# EAGLE design B141X (EAGLE 6.6.0)
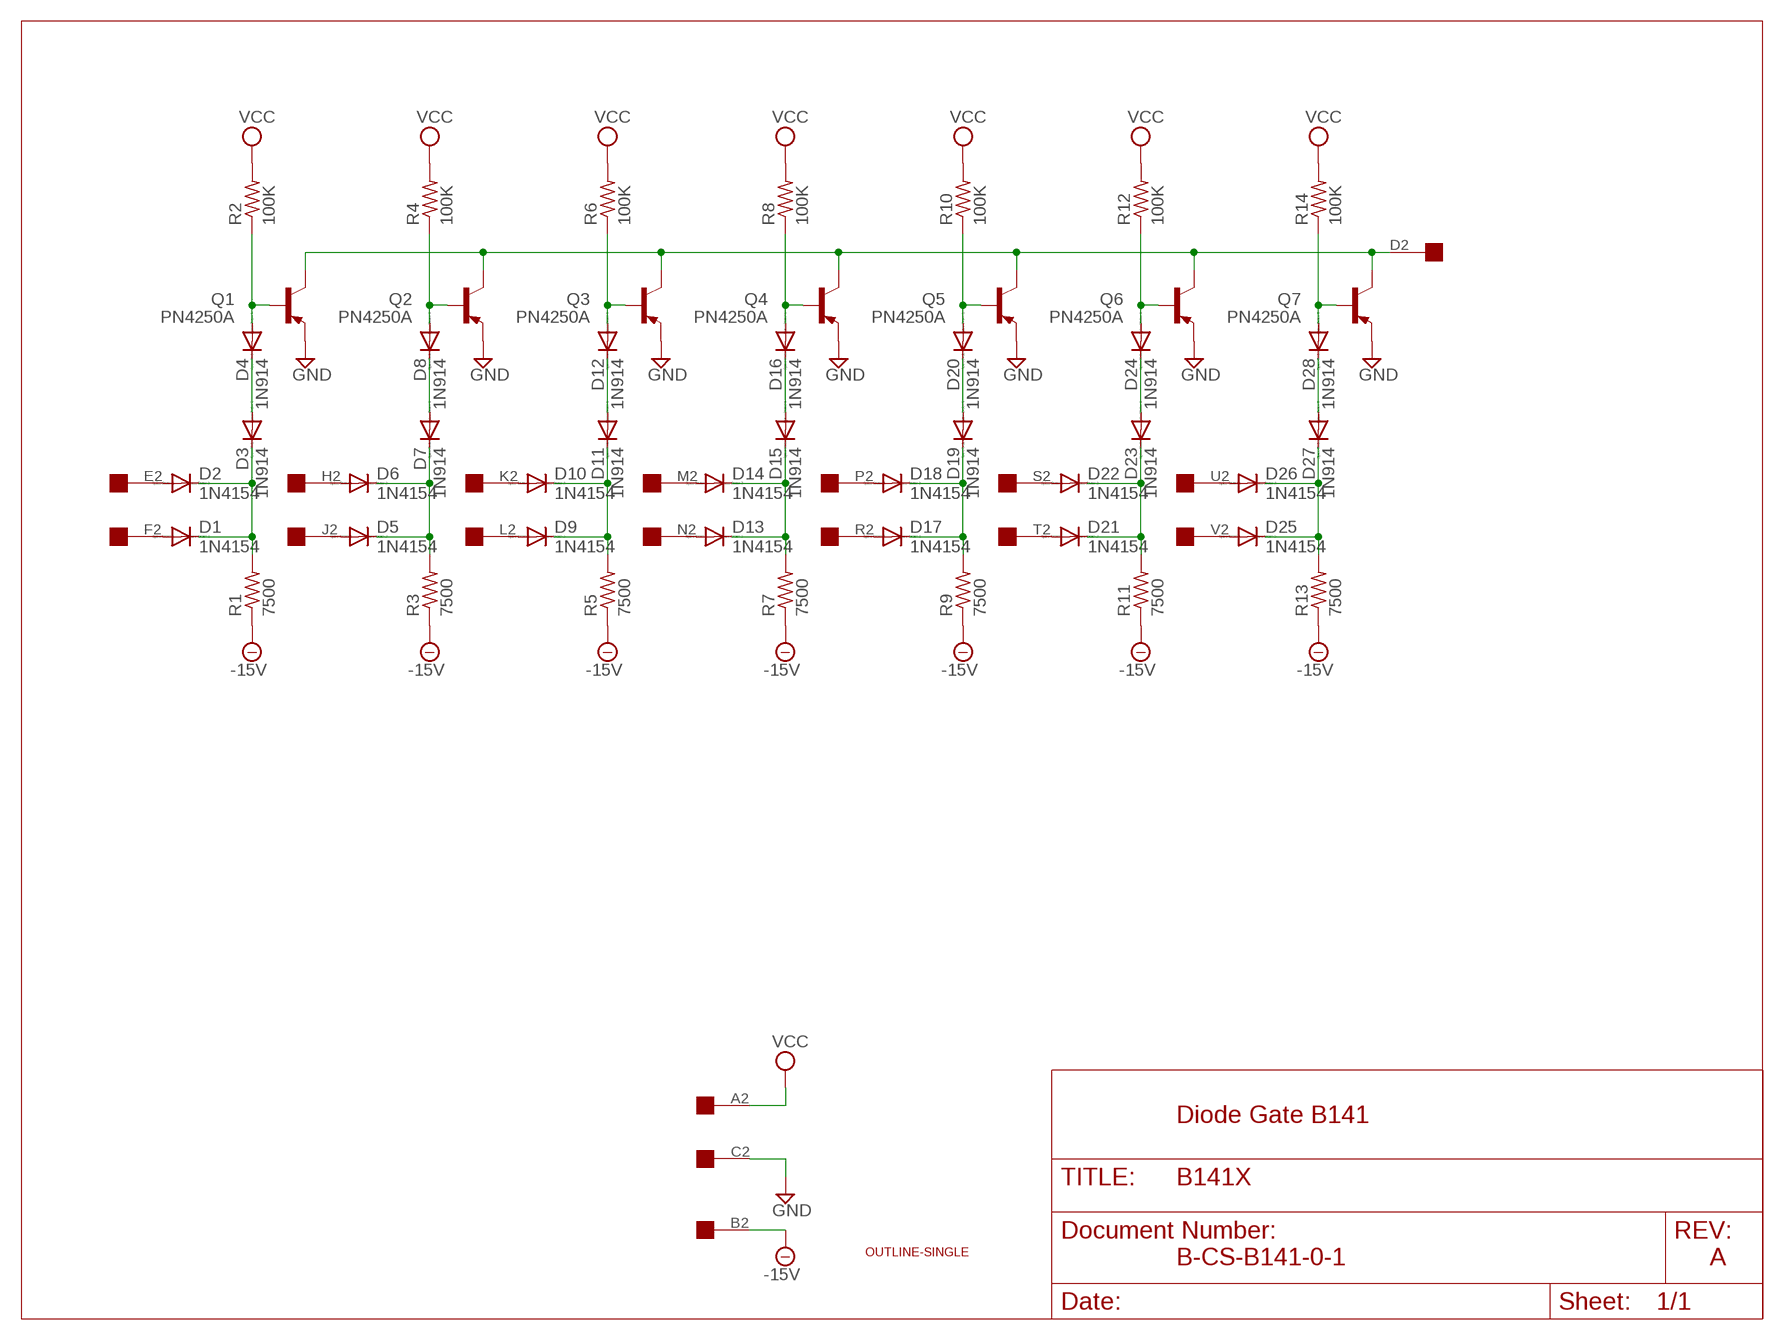
[diagram p0: schematic, sheet 1]

## Parts
D1  1N4154  DIODE-DO35-10  [DO35-10]
D2  1N4154  DIODE-DO35-10  [DO35-10]
D3  1N914  DIODE-DO35-10  [DO35-10]
D4  1N914  DIODE-DO35-10  [DO35-10]
D5  1N4154  DIODE-DO35-10  [DO35-10]
D6  1N4154  DIODE-DO35-10  [DO35-10]
D7  1N914  DIODE-DO35-10  [DO35-10]
D8  1N914  DIODE-DO35-10  [DO35-10]
D9  1N4154  DIODE-DO35-10  [DO35-10]
D10  1N4154  DIODE-DO35-10  [DO35-10]
D11  1N914  DIODE-DO35-10  [DO35-10]
D12  1N914  DIODE-DO35-10  [DO35-10]
D13  1N4154  DIODE-DO35-10  [DO35-10]
D14  1N4154  DIODE-DO35-10  [DO35-10]
D15  1N914  DIODE-DO35-10  [DO35-10]
D16  1N914  DIODE-DO35-10  [DO35-10]
D17  1N4154  DIODE-DO35-10  [DO35-10]
D18  1N4154  DIODE-DO35-10  [DO35-10]
D19  1N914  DIODE-DO35-10  [DO35-10]
D20  1N914  DIODE-DO35-10  [DO35-10]
D21  1N4154  DIODE-DO35-10  [DO35-10]
D22  1N4154  DIODE-DO35-10  [DO35-10]
D23  1N914  DIODE-DO35-10  [DO35-10]
D24  1N914  DIODE-DO35-10  [DO35-10]
D25  1N4154  DIODE-DO35-10  [DO35-10]
D26  1N4154  DIODE-DO35-10  [DO35-10]
D27  1N914  DIODE-DO35-10  [DO35-10]
D28  1N914  DIODE-DO35-10  [DO35-10]
Q1  PN4250A  -PNP-TO5  [TO5]
Q2  PN4250A  -PNP-TO5  [TO5]
Q3  PN4250A  -PNP-TO5  [TO5]
Q4  PN4250A  -PNP-TO5  [TO5]
Q5  PN4250A  -PNP-TO5  [TO5]
Q6  PN4250A  -PNP-TO5  [TO5]
Q7  PN4250A  -PNP-TO5  [TO5]
R1  7500  R-US_0207/10  [0207/10]
R2  100K  R-US_0207/10  [0207/10]
R3  7500  R-US_0207/10  [0207/10]
R4  100K  R-US_0207/10  [0207/10]
R5  7500  R-US_0207/10  [0207/10]
R6  100K  R-US_0207/10  [0207/10]
R7  7500  R-US_0207/10  [0207/10]
R8  100K  R-US_0207/10  [0207/10]
R9  7500  R-US_0207/10  [0207/10]
R10  100K  R-US_0207/10  [0207/10]
R11  7500  R-US_0207/10  [0207/10]
R12  100K  R-US_0207/10  [0207/10]
R13  7500  R-US_0207/10  [0207/10]
R14  100K  R-US_0207/10  [0207/10]
U$1  OUTLINE-SINGLE  [SINGLE]
U$2  EDGE-1  [EDGE-CON1]

## Nets
-15V: R1.1 R3.1 R5.1 R7.1 R9.1 R11.1 R13.1 U$2.B2
GND: Q1.1(E) Q2.1(E) Q3.1(E) Q4.1(E) Q5.1(E) Q6.1(E) Q7.1(E) U$2.C2
N$1: D2.A U$2.E2
N$2: D1.C D2.C D3.C R1.2
N$3: D3.A D4.C
N$4: D1.A U$2.F2
N$5: D4.A Q1.2(B) R2.1
N$6: Q1.3(C) Q2.3(C) Q3.3(C) Q4.3(C) Q5.3(C) Q6.3(C) Q7.3(C) U$2.D2
N$7: D5.C D6.C D7.C R3.2
N$8: D7.A D8.C
N$9: D8.A Q2.2(B) R4.1
N$10: D6.A U$2.H2
N$11: D9.C D10.C D11.C R5.2
N$12: D11.A D12.C
N$13: D12.A Q3.2(B) R6.1
N$14: D10.A U$2.K2
N$15: D13.C D14.C D15.C R7.2
N$16: D15.A D16.C
N$17: D16.A Q4.2(B) R8.1
N$18: D9.A U$2.L2
N$19: D14.A U$2.M2
N$20: D17.C D18.C D19.C R9.2
N$21: D19.A D20.C
N$22: D13.A U$2.N2
N$23: D20.A Q5.2(B) R10.1
N$24: D18.A U$2.P2
N$25: D21.C D22.C D23.C R11.2
N$26: D23.A D24.C
N$27: D24.A Q6.2(B) R12.1
N$28: D17.A U$2.R2
N$29: D25.C D26.C D27.C R13.2
N$30: D27.A D28.C
N$31: D28.A Q7.2(B) R14.1
N$32: D22.A U$2.S2
N$33: D5.A U$2.J2
N$34: D21.A U$2.T2
N$35: D26.A U$2.U2
N$36: D25.A U$2.V2
VCC: R2.2 R4.2 R6.2 R8.2 R10.2 R12.2 R14.2 U$2.A2

## Notes on the sheet
- Diode Gate B141
- B-CS-B141-0-1 | A

## Library data of the parts
D1-D28 = diode:DIODE-: DIODE
Q1-Q7 = transistor:*-PNP-: PNP Transistror
R1-R14 = rcl:R-US_: RESISTOR, American symbol
U$1 = dec-con:OUTLINE-*: Board outlines for DEC boards.
U$2 = dec-con:EDGE-1: Single-Sided DEC Edge Connector -- (side 2)

## Net classes
0 default: width 0.813 mm

## Board
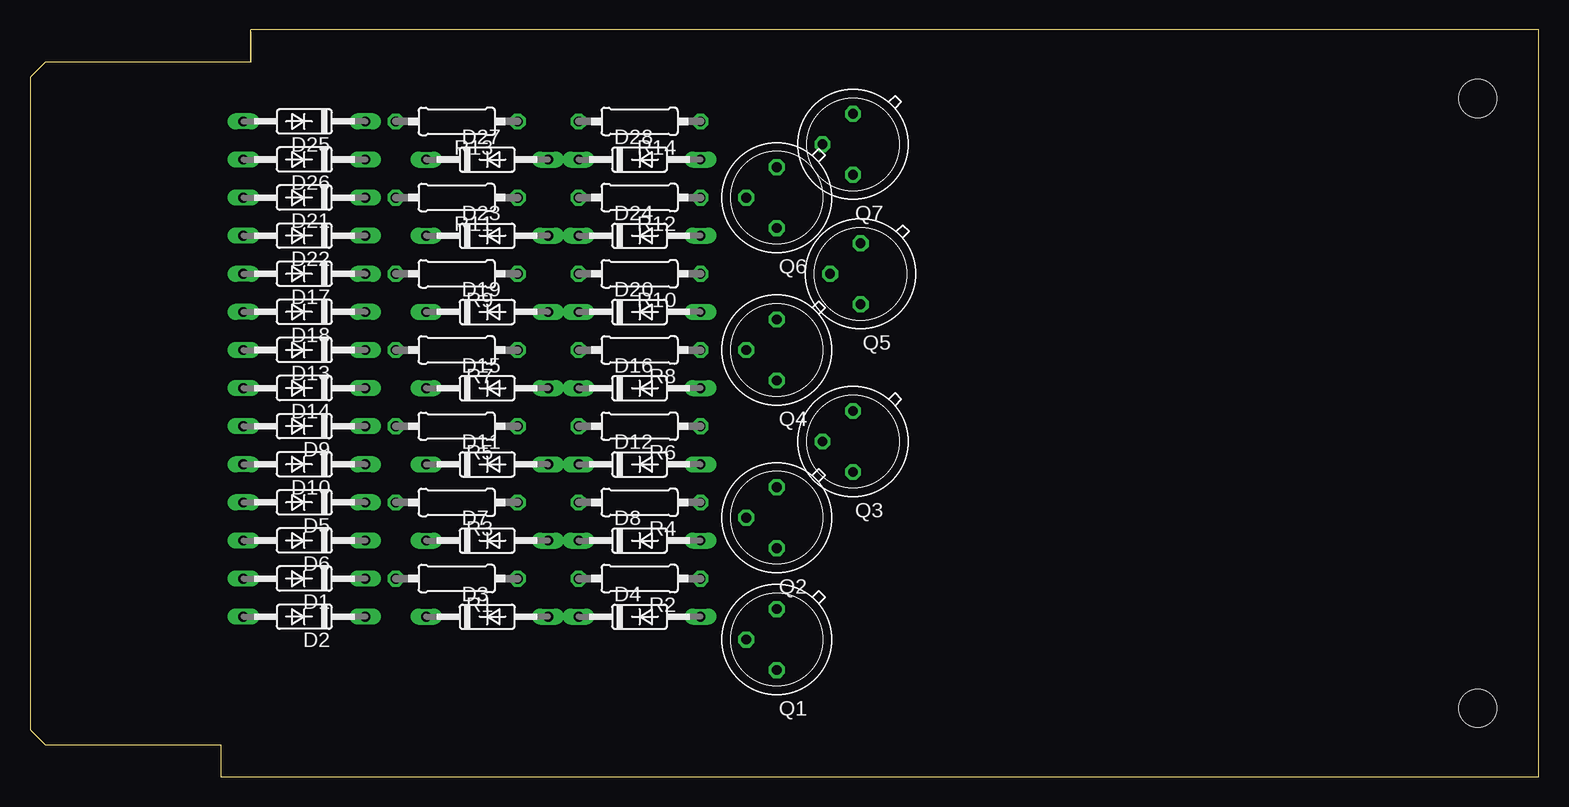
[diagram p1: board, top side]
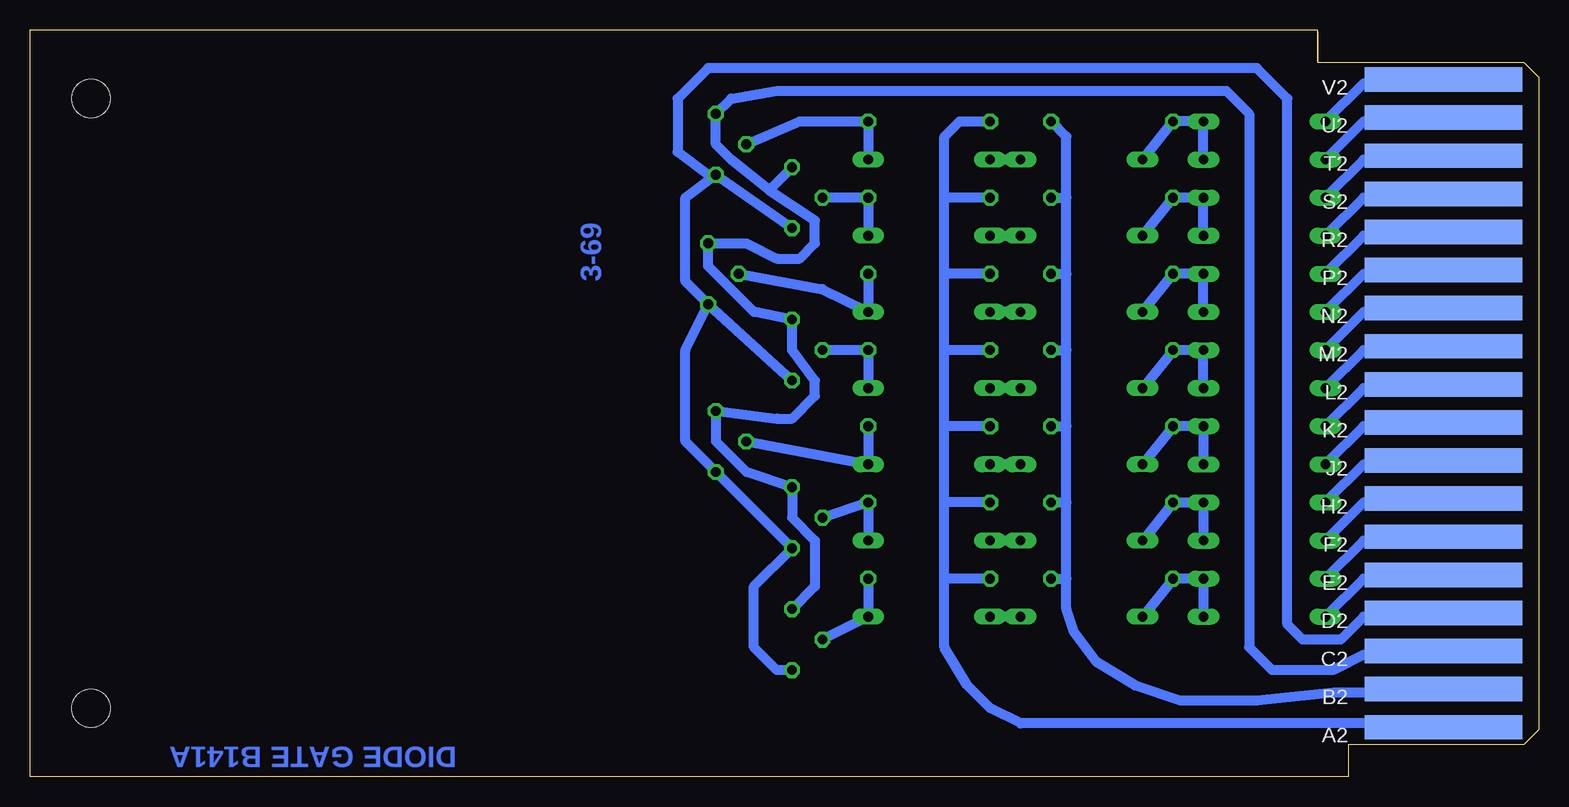
[diagram p2: board, bottom side, seen from below]

Size 125.73 x 62.23 mm. Coordinates in mm from the lower left corner, seen from the top.
Copper layers (1+16): Top 0.035mm / dielectric 1.5mm / Bottom 0.035mm
Design rules "16mils": minimum track width 16mil, minimum drill 32mil, track to track 15mil, track to pad 10mil, pad to pad 10mil, via to via 10mil, smd to smd 10mil, copper to edge 13mil, drill to drill 10mil, minimum pad ring 10mil, minimum via ring 8mil, stop-mask expansion 0mil, vias tented up to drill 0mil, thermal gap 10mil

### Footprints (pad centres in the part's own frame; a part is rotated, then mirrored left to right if it is on the bottom)
DO35-10 = drill 0.813 long: A 5.08,0; C -5.08,0
TO5 = drill 0.813 octagon: 1 0,-2.54; 2 2.54,0; 3 0,2.54
0207/10 = drill 0.813 octagon: 1 -5.08,0; 2 5.08,0
SINGLE = hole 3.175: 120.65,56.515; 120.65,5.715
EDGE-CON1 = smd 13.106 x 2.032 bottom: A2 7.938,4.128; B2 7.938,7.303; C2 7.938,10.477; D2 7.938,13.652; E2 7.938,16.828; F2 7.938,20.003; H2 7.938,23.177; J2 7.938,26.352; K2 7.938,29.527; L2 7.938,32.703; M2 7.938,35.877; N2 7.938,39.053; P2 7.938,42.227; R2 7.938,45.403; S2 7.938,48.578; T2 7.938,51.752; U2 7.938,54.928; V2 7.938,58.102

### Placement (x,y rotation side)
D1  22.86,16.51 180 top
D2  22.86,13.34 180 top
D3  38.1,13.34 0 top
D4  50.8,13.34 0 top
D5  22.86,22.86 180 top
D6  22.86,19.68 180 top
D7  38.1,19.68 0 top
D8  50.8,19.68 0 top
D9  22.86,29.21 180 top
D10  22.86,26.04 180 top
D11  38.1,26.04 0 top
D12  50.8,26.04 0 top
D13  22.86,35.56 180 top
D14  22.86,32.38 180 top
D15  38.1,32.38 0 top
D16  50.8,32.38 0 top
D17  22.86,41.91 180 top
D18  22.86,38.73 180 top
D19  38.1,38.73 0 top
D20  50.8,38.73 0 top
D21  22.86,48.26 180 top
D22  22.86,45.09 180 top
D23  38.1,45.09 0 top
D24  50.8,45.09 0 top
D25  22.86,54.61 180 top
D26  22.86,51.44 180 top
D27  38.1,51.44 0 top
D28  50.8,51.44 0 top
Q1  62.23,11.43 180 top
Q2  62.23,21.59 180 top
Q3  68.58,27.94 180 top
Q4  62.23,35.56 180 top
Q5  69.22,41.91 180 top
Q6  62.23,48.26 180 top
Q7  68.58,52.7 180 top
R1  35.56,16.51 180 top
R2  50.8,16.51 180 top
R3  35.56,22.86 180 top
R4  50.8,22.86 180 top
R5  35.56,29.21 180 top
R6  50.8,29.21 180 top
R7  35.56,35.56 180 top
R8  50.8,35.56 180 top
R9  35.56,41.91 180 top
R10  50.8,41.91 180 top
R11  35.56,48.26 180 top
R12  50.8,48.26 180 top
R13  35.56,54.61 180 top
R14  50.8,54.61 180 top
U$1  0,0 0 top
U$2  0,0 0 top

### Tracks (layer width: path | path; a pad name or v marks a point on that pad's centre or on a via)
-15V
  Bottom 0.813: U$2.B2 8.26,6.99 17.15,6.99 23.5,6.35 29.85,6.35 33.66,7.62 36.83,9.53 38.74,12.06 39.37,13.97 39.37,16.51 | 39.37,16.51 39.37,22.86 | 39.37,22.86 39.37,29.21 | 39.37,29.21 39.37,35.56 | 39.37,35.56 39.37,41.91 | 39.37,41.91 39.37,48.26 | 39.37,48.26 39.37,53.34 R13.1 | R11.1 39.37,48.26 | R9.1 39.37,41.91 | R7.1 39.37,35.56 | R5.1 39.37,29.21 | R3.1 39.37,22.86 | R1.1 39.37,16.51
GND
  Bottom 0.813: Q1.1 60.33,15.88 60.33,19.68 62.23,21.59 Q2.1 66.04,25.4 68.58,27.94 Q3.1 63.5,29.84 62.23,29.84 60.33,31.75 60.33,33.02 62.23,35.56 Q4.1 65.41,38.73 69.22,42.55 Q5.1 66.04,44.45 63.5,43.18 61.6,43.18 60.33,44.45 60.33,46.35 64.14,48.9 | Q6.1 64.14,48.9 | 64.14,48.9 67.31,51.44 68.58,52.7 Q7.1 67.31,56.52 63.5,57.15 26.04,57.15 24.13,55.24 24.13,10.79 22.23,8.89 17.15,8.89 14.61,10.16 8.89,10.16 U$2.C2
N$1
  Bottom 0.813: U$2.E2 8.26,16.51 14.61,16.51 D2.A
N$2
  Bottom 0.813: D2.C D1.C R1.2 D3.C
N$3
  Bottom 0.813: D3.A D4.C
N$4
  Bottom 0.813: U$2.F2 8.26,19.68 14.61,19.68 D1.A
N$5
  Bottom 0.813: Q1.2 D4.A R2.1
N$6
  Bottom 0.813: U$2.D2 8.26,13.34 14.61,13.34 16.51,11.43 19.69,11.43 20.96,12.7 20.96,56.52 23.5,59.05 69.22,59.05 71.76,56.52 71.76,52.07 69.22,50.16 Q7.3 | Q7.3 Q6.3 | Q4.3 Q5.3 | Q1.3 63.5,8.89 65.41,10.79 65.41,15.88 Q2.3 Q3.3 71.12,27.94 71.12,35.56 Q5.3 | Q5.3 71.12,41.27 71.12,48.26 Q7.3
N$7
  Bottom 0.813: D7.C R3.2 D5.C D6.C
N$8
  Bottom 0.813: D7.A D8.C
N$9
  Bottom 0.813: Q2.2 R4.1 D8.A
N$10
  Bottom 0.813: U$2.H2 8.26,22.86 14.61,22.86 D6.A
N$11
  Bottom 0.813: D11.C R5.2 D9.C D10.C
N$12
  Bottom 0.813: D11.A D12.C
N$13
  Bottom 0.813: R6.1 D12.A Q3.2
N$14
  Bottom 0.813: U$2.K2 8.26,29.21 14.61,29.21 D10.A
N$15
  Bottom 0.813: D15.C R7.2 D13.C D14.C
N$16
  Bottom 0.813: D15.A D16.C
N$17
  Bottom 0.813: Q4.2 R8.1 D16.A
N$18
  Bottom 0.813: U$2.L2 8.26,32.38 14.61,32.38 D9.A
N$19
  Bottom 0.813: U$2.M2 8.26,35.56 14.61,35.56 D14.A
N$20
  Bottom 0.813: D18.C D17.C R9.2 D19.C
N$21
  Bottom 0.813: D19.A D20.C
N$22
  Bottom 0.813: U$2.N2 8.26,38.73 14.61,38.73 D13.A
N$23
  Bottom 0.813: R10.1 D20.A 59.69,40.64 Q5.2
N$24
  Bottom 0.813: U$2.P2 8.26,41.91 14.61,41.91 D18.A
N$25
  Bottom 0.813: D22.C D21.C R11.2 D23.C
N$26
  Bottom 0.813: D24.C D23.A
N$27
  Bottom 0.813: Q6.2 R12.1 D24.A
N$28
  Bottom 0.813: U$2.R2 8.26,45.09 14.61,45.09 D17.A
N$29
  Bottom 0.813: D26.C D25.C R13.2 D27.C
N$30
  Bottom 0.813: D27.A D28.C
N$31
  Bottom 0.813: D28.A R14.1 61.6,54.61 Q7.2
N$32
  Bottom 0.813: U$2.S2 8.26,48.26 14.61,48.26 D22.A
N$33
  Bottom 0.813: U$2.J2 8.26,26.04 14.61,26.04 D5.A
N$34
  Bottom 0.813: U$2.T2 8.26,51.44 14.61,51.44 D21.A
N$35
  Bottom 0.813: U$2.U2 8.26,54.61 14.61,54.61 D26.A
N$36
  Bottom 0.813: U$2.V2 8.26,57.78 14.61,57.78 D25.A
VCC
  Bottom 0.813: R2.2 49.53,16.51 | 49.53,16.51 49.53,22.86 | 49.53,22.86 49.53,29.21 | 49.53,29.21 49.53,35.56 | 49.53,35.56 49.53,41.91 | 49.53,41.91 49.53,48.26 | 49.53,48.26 49.53,53.34 48.26,54.61 R14.2 | R12.2 49.53,48.26 | R10.2 49.53,41.91 | R8.2 49.53,35.56 | R6.2 49.53,29.21 | R4.2 49.53,22.86 | U$2.A2 8.89,4.45 43.18,4.45 45.72,5.71 47.63,7.62 49.53,10.79 49.53,16.51

### Text on the board
Bottom: 3-69 | DIODE GATE B141A